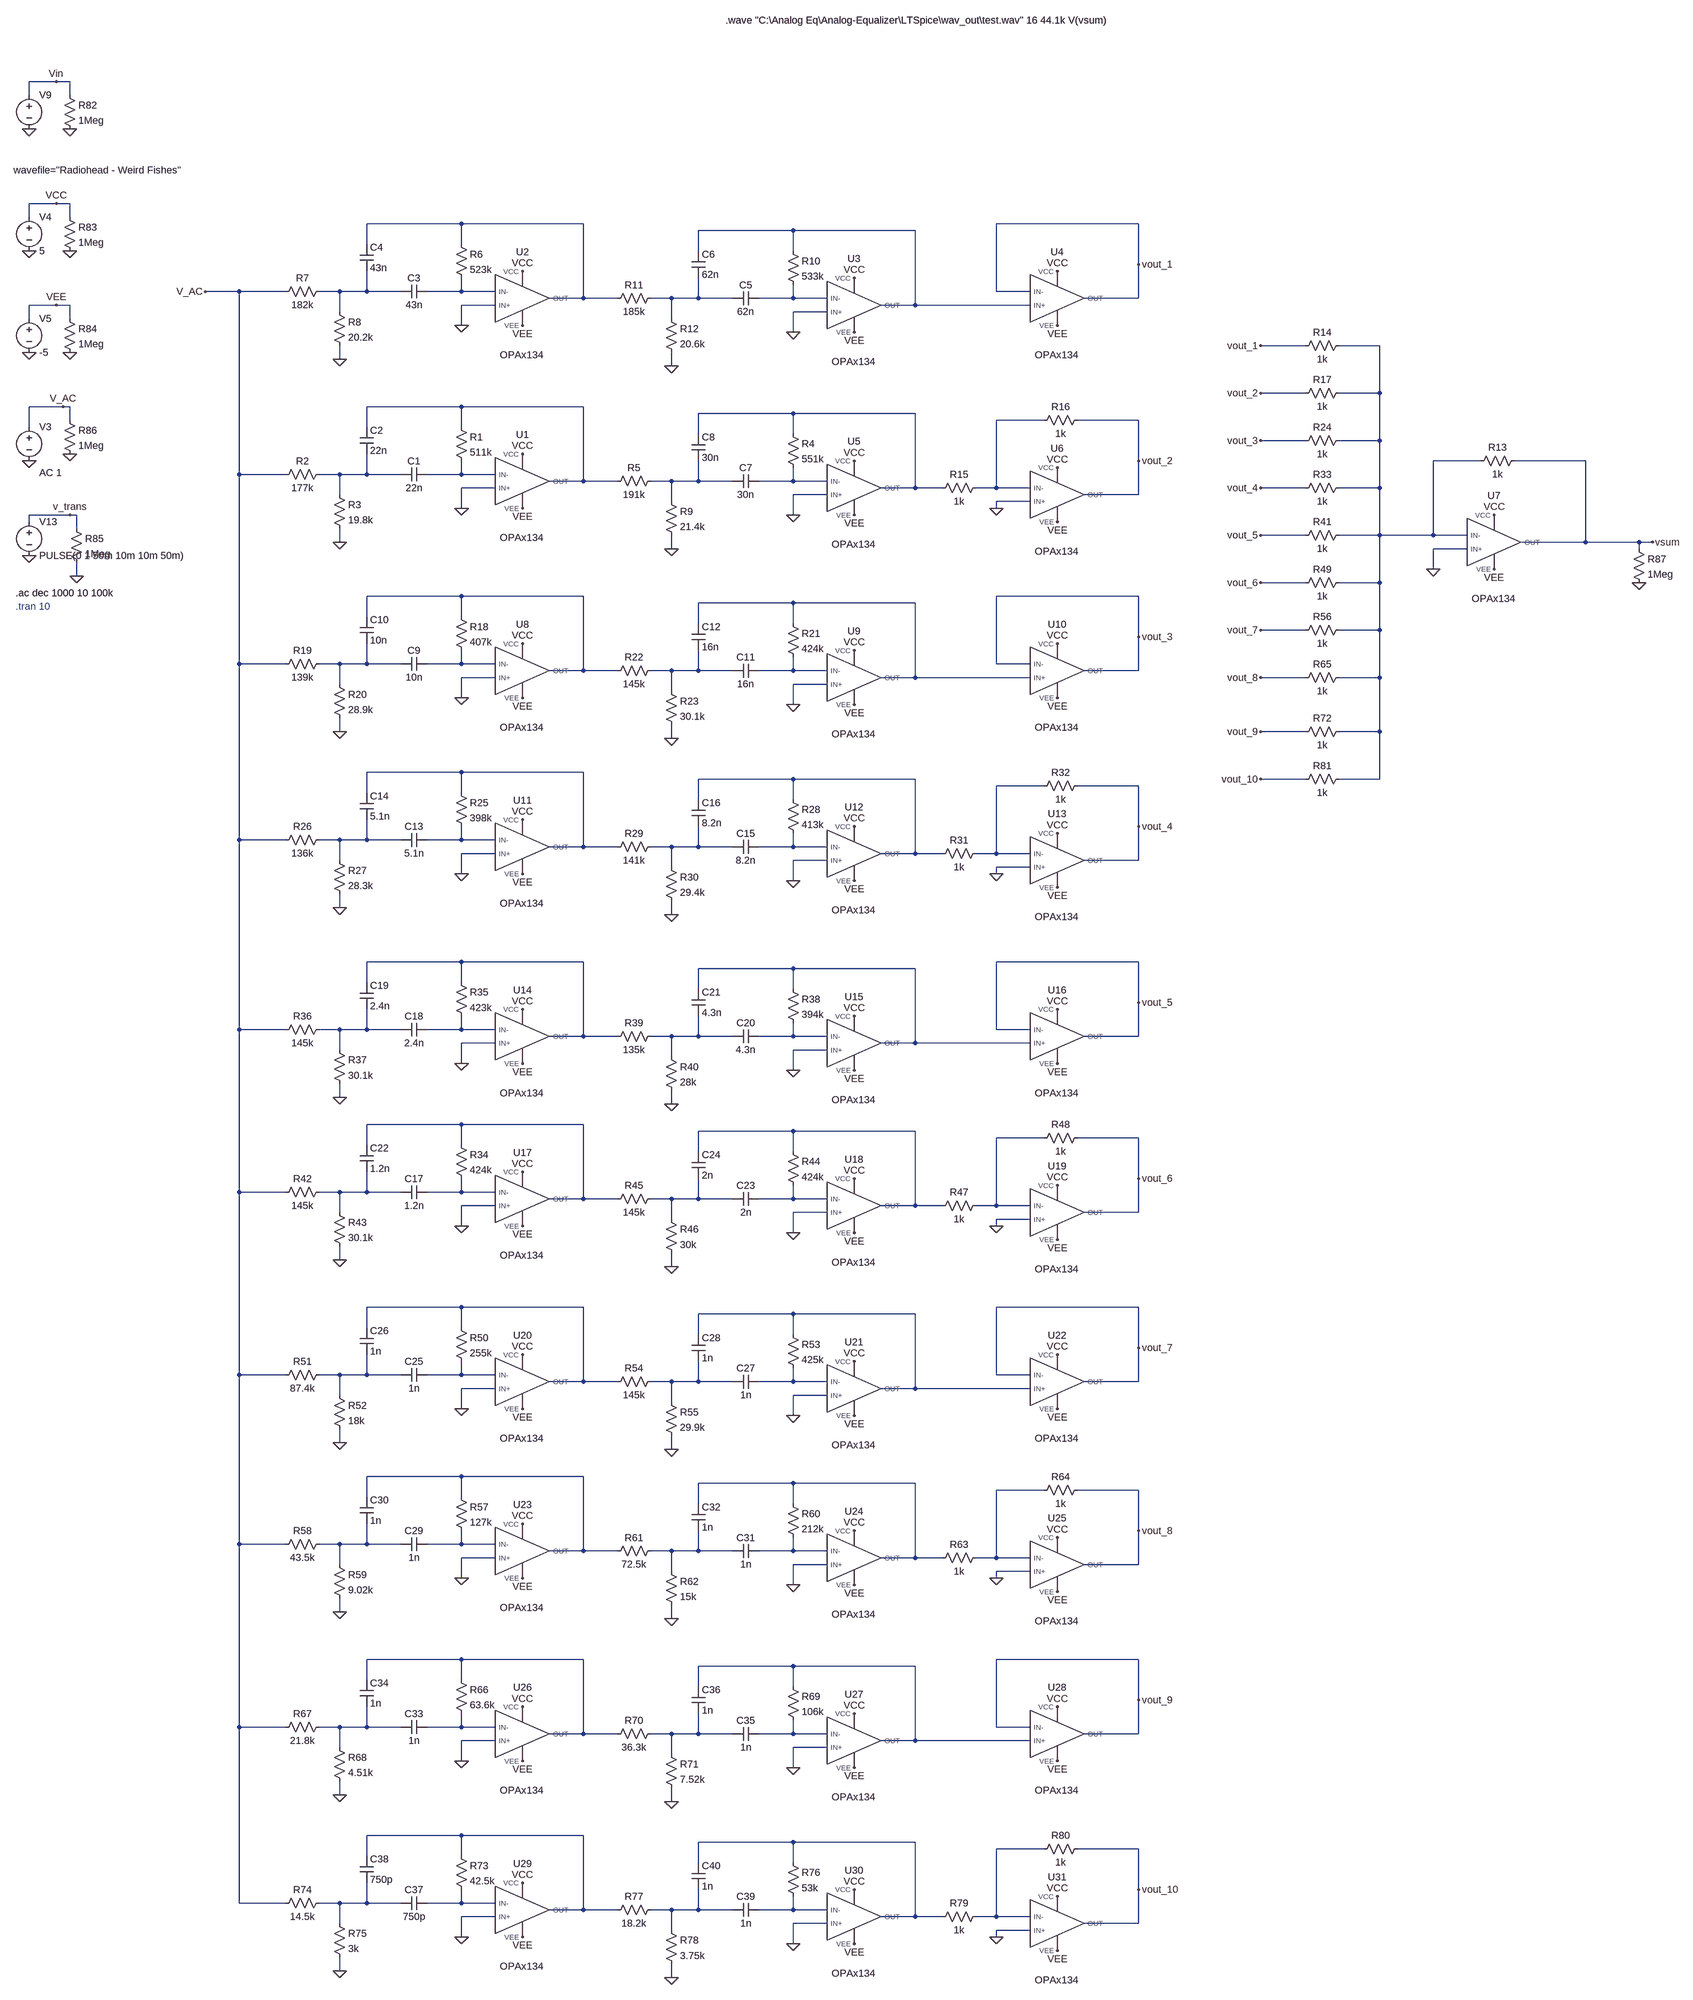
[diagram p0: schematic analog_eq_linkwitz_riley.asc]
analog_eq_linkwitz_riley.asc, the LTspice schematic file:
Version 4.1
SHEET 1 3844 4724
WIRE -512 224 -576 224
WIRE -480 224 -512 224
WIRE -576 256 -576 224
WIRE -480 256 -480 224
WIRE -512 512 -576 512
WIRE -480 512 -512 512
WIRE -576 544 -576 512
WIRE -480 544 -480 512
WIRE 464 560 240 560
WIRE 752 560 464 560
WIRE 2064 560 1728 560
WIRE 1248 576 1024 576
WIRE 1536 576 1248 576
WIRE 240 608 240 560
WIRE 464 608 464 560
WIRE 1024 624 1024 576
WIRE 1248 624 1248 576
WIRE 2064 656 2064 560
WIRE -80 720 -160 720
WIRE 48 720 -80 720
WIRE 176 720 128 720
WIRE 240 720 240 672
WIRE 240 720 176 720
WIRE 320 720 240 720
WIRE 464 720 464 688
WIRE 464 720 384 720
WIRE 544 720 464 720
WIRE 1728 720 1728 560
WIRE 1808 720 1728 720
WIRE 752 736 752 560
WIRE 752 736 672 736
WIRE 832 736 752 736
WIRE 960 736 912 736
WIRE 1024 736 1024 688
WIRE 1024 736 960 736
WIRE 1104 736 1024 736
WIRE 1248 736 1248 704
WIRE 1248 736 1168 736
WIRE 1328 736 1248 736
WIRE 2064 736 2064 656
WIRE 2064 736 1936 736
WIRE -512 752 -576 752
WIRE -480 752 -512 752
WIRE 544 752 464 752
WIRE 1536 752 1536 576
WIRE 1536 752 1456 752
WIRE 1808 752 1536 752
WIRE 176 768 176 720
WIRE 1328 768 1248 768
WIRE -576 784 -576 752
WIRE -480 784 -480 752
WIRE 960 784 960 736
WIRE 464 800 464 752
WIRE 1248 816 1248 768
WIRE 2768 848 2656 848
WIRE 2944 848 2848 848
WIRE 176 880 176 848
WIRE 960 896 960 864
WIRE 2768 960 2656 960
WIRE 2944 960 2944 848
WIRE 2944 960 2848 960
WIRE -496 992 -576 992
WIRE -480 992 -496 992
WIRE 464 992 240 992
WIRE 752 992 464 992
WIRE 1248 1008 1024 1008
WIRE 1536 1008 1248 1008
WIRE -480 1024 -480 992
WIRE 1840 1024 1728 1024
WIRE 2064 1024 1920 1024
WIRE -576 1040 -576 992
WIRE 240 1040 240 992
WIRE 464 1040 464 992
WIRE 1024 1056 1024 1008
WIRE 1248 1056 1248 1008
WIRE 2768 1072 2656 1072
WIRE 2944 1072 2944 960
WIRE 2944 1072 2848 1072
WIRE 2064 1120 2064 1024
WIRE 3184 1120 3072 1120
WIRE 3440 1120 3264 1120
WIRE -80 1152 -80 720
WIRE 48 1152 -80 1152
WIRE 176 1152 128 1152
WIRE 240 1152 240 1104
WIRE 240 1152 176 1152
WIRE 320 1152 240 1152
WIRE 464 1152 464 1120
WIRE 464 1152 384 1152
WIRE 544 1152 464 1152
WIRE 752 1168 752 992
WIRE 752 1168 672 1168
WIRE 832 1168 752 1168
WIRE 960 1168 912 1168
WIRE 1024 1168 1024 1120
WIRE 1024 1168 960 1168
WIRE 1104 1168 1024 1168
WIRE 1248 1168 1248 1136
WIRE 1248 1168 1168 1168
WIRE 1328 1168 1248 1168
WIRE 544 1184 464 1184
WIRE 1536 1184 1536 1008
WIRE 1536 1184 1456 1184
WIRE 1600 1184 1536 1184
WIRE 1728 1184 1728 1024
WIRE 1728 1184 1680 1184
WIRE 1808 1184 1728 1184
WIRE 2768 1184 2656 1184
WIRE 2944 1184 2944 1072
WIRE 2944 1184 2848 1184
WIRE 176 1200 176 1152
WIRE 1328 1200 1248 1200
WIRE 2064 1200 2064 1120
WIRE 2064 1200 1936 1200
WIRE 960 1216 960 1168
WIRE 1808 1216 1728 1216
WIRE 464 1232 464 1184
WIRE 1728 1232 1728 1216
WIRE -480 1248 -576 1248
WIRE -464 1248 -480 1248
WIRE 1248 1248 1248 1200
WIRE -576 1264 -576 1248
WIRE -464 1280 -464 1248
WIRE 2768 1296 2656 1296
WIRE 2944 1296 2944 1184
WIRE 2944 1296 2848 1296
WIRE 3072 1296 3072 1120
WIRE 3072 1296 2944 1296
WIRE 3152 1296 3072 1296
WIRE 176 1312 176 1280
WIRE 3440 1312 3440 1120
WIRE 3440 1312 3280 1312
WIRE 3600 1312 3440 1312
WIRE 3632 1312 3600 1312
WIRE 960 1328 960 1296
WIRE 3152 1328 3072 1328
WIRE 3600 1328 3600 1312
WIRE 3072 1376 3072 1328
WIRE -464 1392 -464 1360
WIRE 2768 1408 2656 1408
WIRE 2944 1408 2944 1296
WIRE 2944 1408 2848 1408
WIRE 464 1440 240 1440
WIRE 752 1440 464 1440
WIRE 2064 1440 1728 1440
WIRE 1248 1456 1024 1456
WIRE 1536 1456 1248 1456
WIRE 240 1488 240 1440
WIRE 464 1488 464 1440
WIRE 1024 1504 1024 1456
WIRE 1248 1504 1248 1456
WIRE 2768 1520 2656 1520
WIRE 2944 1520 2944 1408
WIRE 2944 1520 2848 1520
WIRE 2064 1536 2064 1440
WIRE -80 1600 -80 1152
WIRE 48 1600 -80 1600
WIRE 176 1600 128 1600
WIRE 240 1600 240 1552
WIRE 240 1600 176 1600
WIRE 320 1600 240 1600
WIRE 464 1600 464 1568
WIRE 464 1600 384 1600
WIRE 544 1600 464 1600
WIRE 1728 1600 1728 1440
WIRE 1808 1600 1728 1600
WIRE 752 1616 752 1440
WIRE 752 1616 672 1616
WIRE 832 1616 752 1616
WIRE 960 1616 912 1616
WIRE 1024 1616 1024 1568
WIRE 1024 1616 960 1616
WIRE 1104 1616 1024 1616
WIRE 1248 1616 1248 1584
WIRE 1248 1616 1168 1616
WIRE 1328 1616 1248 1616
WIRE 2064 1616 2064 1536
WIRE 2064 1616 1936 1616
WIRE 544 1632 464 1632
WIRE 1536 1632 1536 1456
WIRE 1536 1632 1456 1632
WIRE 1808 1632 1536 1632
WIRE 2768 1632 2656 1632
WIRE 2944 1632 2944 1520
WIRE 2944 1632 2848 1632
WIRE 176 1648 176 1600
WIRE 1328 1648 1248 1648
WIRE 960 1664 960 1616
WIRE 464 1680 464 1632
WIRE 1248 1696 1248 1648
WIRE 176 1760 176 1728
WIRE 2768 1760 2656 1760
WIRE 2944 1760 2944 1632
WIRE 2944 1760 2848 1760
WIRE 960 1776 960 1744
WIRE 464 1856 240 1856
WIRE 752 1856 464 1856
WIRE 1248 1872 1024 1872
WIRE 1536 1872 1248 1872
WIRE 2768 1872 2656 1872
WIRE 2944 1872 2944 1760
WIRE 2944 1872 2848 1872
WIRE 1840 1888 1728 1888
WIRE 2064 1888 1920 1888
WIRE 240 1904 240 1856
WIRE 464 1904 464 1856
WIRE 1024 1920 1024 1872
WIRE 1248 1920 1248 1872
WIRE 2064 1984 2064 1888
WIRE -80 2016 -80 1600
WIRE 48 2016 -80 2016
WIRE 176 2016 128 2016
WIRE 240 2016 240 1968
WIRE 240 2016 176 2016
WIRE 320 2016 240 2016
WIRE 464 2016 464 1984
WIRE 464 2016 384 2016
WIRE 544 2016 464 2016
WIRE 752 2032 752 1856
WIRE 752 2032 672 2032
WIRE 832 2032 752 2032
WIRE 960 2032 912 2032
WIRE 1024 2032 1024 1984
WIRE 1024 2032 960 2032
WIRE 1104 2032 1024 2032
WIRE 1248 2032 1248 2000
WIRE 1248 2032 1168 2032
WIRE 1328 2032 1248 2032
WIRE 544 2048 464 2048
WIRE 1536 2048 1536 1872
WIRE 1536 2048 1456 2048
WIRE 1600 2048 1536 2048
WIRE 1728 2048 1728 1888
WIRE 1728 2048 1680 2048
WIRE 1808 2048 1728 2048
WIRE 176 2064 176 2016
WIRE 1328 2064 1248 2064
WIRE 2064 2064 2064 1984
WIRE 2064 2064 1936 2064
WIRE 960 2080 960 2032
WIRE 1808 2080 1728 2080
WIRE 464 2096 464 2048
WIRE 1728 2096 1728 2080
WIRE 1248 2112 1248 2064
WIRE 176 2176 176 2144
WIRE 960 2192 960 2160
WIRE 464 2304 240 2304
WIRE 752 2304 464 2304
WIRE 2064 2304 1728 2304
WIRE 1248 2320 1024 2320
WIRE 1536 2320 1248 2320
WIRE 240 2352 240 2304
WIRE 464 2352 464 2304
WIRE 1024 2368 1024 2320
WIRE 1248 2368 1248 2320
WIRE 2064 2400 2064 2304
WIRE -80 2464 -80 2016
WIRE 48 2464 -80 2464
WIRE 176 2464 128 2464
WIRE 240 2464 240 2416
WIRE 240 2464 176 2464
WIRE 320 2464 240 2464
WIRE 464 2464 464 2432
WIRE 464 2464 384 2464
WIRE 544 2464 464 2464
WIRE 1728 2464 1728 2304
WIRE 1808 2464 1728 2464
WIRE 752 2480 752 2304
WIRE 752 2480 672 2480
WIRE 832 2480 752 2480
WIRE 960 2480 912 2480
WIRE 1024 2480 1024 2432
WIRE 1024 2480 960 2480
WIRE 1104 2480 1024 2480
WIRE 1248 2480 1248 2448
WIRE 1248 2480 1168 2480
WIRE 1328 2480 1248 2480
WIRE 2064 2480 2064 2400
WIRE 2064 2480 1936 2480
WIRE 544 2496 464 2496
WIRE 1536 2496 1536 2320
WIRE 1536 2496 1456 2496
WIRE 1808 2496 1536 2496
WIRE 176 2512 176 2464
WIRE 1328 2512 1248 2512
WIRE 960 2528 960 2480
WIRE 464 2544 464 2496
WIRE 1248 2560 1248 2512
WIRE 176 2624 176 2592
WIRE 960 2640 960 2608
WIRE 464 2688 240 2688
WIRE 752 2688 464 2688
WIRE 1248 2704 1024 2704
WIRE 1536 2704 1248 2704
WIRE 1840 2720 1728 2720
WIRE 2064 2720 1920 2720
WIRE 240 2736 240 2688
WIRE 464 2736 464 2688
WIRE 1024 2752 1024 2704
WIRE 1248 2752 1248 2704
WIRE 2064 2816 2064 2720
WIRE -80 2848 -80 2464
WIRE 48 2848 -80 2848
WIRE 176 2848 128 2848
WIRE 240 2848 240 2800
WIRE 240 2848 176 2848
WIRE 320 2848 240 2848
WIRE 464 2848 464 2816
WIRE 464 2848 384 2848
WIRE 544 2848 464 2848
WIRE 752 2864 752 2688
WIRE 752 2864 672 2864
WIRE 832 2864 752 2864
WIRE 960 2864 912 2864
WIRE 1024 2864 1024 2816
WIRE 1024 2864 960 2864
WIRE 1104 2864 1024 2864
WIRE 1248 2864 1248 2832
WIRE 1248 2864 1168 2864
WIRE 1328 2864 1248 2864
WIRE 544 2880 464 2880
WIRE 1536 2880 1536 2704
WIRE 1536 2880 1456 2880
WIRE 1600 2880 1536 2880
WIRE 1728 2880 1728 2720
WIRE 1728 2880 1680 2880
WIRE 1808 2880 1728 2880
WIRE 176 2896 176 2848
WIRE 1328 2896 1248 2896
WIRE 2064 2896 2064 2816
WIRE 2064 2896 1936 2896
WIRE 960 2912 960 2864
WIRE 1808 2912 1728 2912
WIRE 464 2928 464 2880
WIRE 1728 2928 1728 2912
WIRE 1248 2944 1248 2896
WIRE 176 3008 176 2976
WIRE 960 3024 960 2992
WIRE 464 3120 240 3120
WIRE 752 3120 464 3120
WIRE 2064 3120 1728 3120
WIRE 1248 3136 1024 3136
WIRE 1536 3136 1248 3136
WIRE 240 3168 240 3120
WIRE 464 3168 464 3120
WIRE 1024 3184 1024 3136
WIRE 1248 3184 1248 3136
WIRE 2064 3216 2064 3120
WIRE -80 3280 -80 2848
WIRE 48 3280 -80 3280
WIRE 176 3280 128 3280
WIRE 240 3280 240 3232
WIRE 240 3280 176 3280
WIRE 320 3280 240 3280
WIRE 464 3280 464 3248
WIRE 464 3280 384 3280
WIRE 544 3280 464 3280
WIRE 1728 3280 1728 3120
WIRE 1808 3280 1728 3280
WIRE 752 3296 752 3120
WIRE 752 3296 672 3296
WIRE 832 3296 752 3296
WIRE 960 3296 912 3296
WIRE 1024 3296 1024 3248
WIRE 1024 3296 960 3296
WIRE 1104 3296 1024 3296
WIRE 1248 3296 1248 3264
WIRE 1248 3296 1168 3296
WIRE 1328 3296 1248 3296
WIRE 2064 3296 2064 3216
WIRE 2064 3296 1936 3296
WIRE 544 3312 464 3312
WIRE 1536 3312 1536 3136
WIRE 1536 3312 1456 3312
WIRE 1808 3312 1536 3312
WIRE 176 3328 176 3280
WIRE 1328 3328 1248 3328
WIRE 960 3344 960 3296
WIRE 464 3360 464 3312
WIRE 1248 3376 1248 3328
WIRE 176 3440 176 3408
WIRE 960 3456 960 3424
WIRE 464 3520 240 3520
WIRE 752 3520 464 3520
WIRE 1248 3536 1024 3536
WIRE 1536 3536 1248 3536
WIRE 1840 3552 1728 3552
WIRE 2064 3552 1920 3552
WIRE 240 3568 240 3520
WIRE 464 3568 464 3520
WIRE 1024 3584 1024 3536
WIRE 1248 3584 1248 3536
WIRE 2064 3648 2064 3552
WIRE -80 3680 -80 3280
WIRE 48 3680 -80 3680
WIRE 176 3680 128 3680
WIRE 240 3680 240 3632
WIRE 240 3680 176 3680
WIRE 320 3680 240 3680
WIRE 464 3680 464 3648
WIRE 464 3680 384 3680
WIRE 544 3680 464 3680
WIRE 752 3696 752 3520
WIRE 752 3696 672 3696
WIRE 832 3696 752 3696
WIRE 960 3696 912 3696
WIRE 1024 3696 1024 3648
WIRE 1024 3696 960 3696
WIRE 1104 3696 1024 3696
WIRE 1248 3696 1248 3664
WIRE 1248 3696 1168 3696
WIRE 1328 3696 1248 3696
WIRE 544 3712 464 3712
WIRE 1536 3712 1536 3536
WIRE 1536 3712 1456 3712
WIRE 1600 3712 1536 3712
WIRE 1728 3712 1728 3552
WIRE 1728 3712 1680 3712
WIRE 1808 3712 1728 3712
WIRE 176 3728 176 3680
WIRE 1328 3728 1248 3728
WIRE 2064 3728 2064 3648
WIRE 2064 3728 1936 3728
WIRE 960 3744 960 3696
WIRE 1808 3744 1728 3744
WIRE 464 3760 464 3712
WIRE 1728 3760 1728 3744
WIRE 1248 3776 1248 3728
WIRE 176 3840 176 3808
WIRE 960 3856 960 3824
WIRE 464 3952 240 3952
WIRE 752 3952 464 3952
WIRE 2064 3952 1728 3952
WIRE 1248 3968 1024 3968
WIRE 1536 3968 1248 3968
WIRE 240 4000 240 3952
WIRE 464 4000 464 3952
WIRE 1024 4016 1024 3968
WIRE 1248 4016 1248 3968
WIRE 2064 4048 2064 3952
WIRE -80 4112 -80 3680
WIRE 48 4112 -80 4112
WIRE 176 4112 128 4112
WIRE 240 4112 240 4064
WIRE 240 4112 176 4112
WIRE 320 4112 240 4112
WIRE 464 4112 464 4080
WIRE 464 4112 384 4112
WIRE 544 4112 464 4112
WIRE 1728 4112 1728 3952
WIRE 1808 4112 1728 4112
WIRE 752 4128 752 3952
WIRE 752 4128 672 4128
WIRE 832 4128 752 4128
WIRE 960 4128 912 4128
WIRE 1024 4128 1024 4080
WIRE 1024 4128 960 4128
WIRE 1104 4128 1024 4128
WIRE 1248 4128 1248 4096
WIRE 1248 4128 1168 4128
WIRE 1328 4128 1248 4128
WIRE 2064 4128 2064 4048
WIRE 2064 4128 1936 4128
WIRE 544 4144 464 4144
WIRE 1536 4144 1536 3968
WIRE 1536 4144 1456 4144
WIRE 1808 4144 1536 4144
WIRE 176 4160 176 4112
WIRE 1328 4160 1248 4160
WIRE 960 4176 960 4128
WIRE 464 4192 464 4144
WIRE 1248 4208 1248 4160
WIRE 176 4272 176 4240
WIRE 960 4288 960 4256
WIRE 464 4368 240 4368
WIRE 752 4368 464 4368
WIRE 1248 4384 1024 4384
WIRE 1536 4384 1248 4384
WIRE 1840 4400 1728 4400
WIRE 2064 4400 1920 4400
WIRE 240 4416 240 4368
WIRE 464 4416 464 4368
WIRE 1024 4432 1024 4384
WIRE 1248 4432 1248 4384
WIRE 2064 4496 2064 4400
WIRE -80 4528 -80 4112
WIRE 48 4528 -80 4528
WIRE 176 4528 128 4528
WIRE 240 4528 240 4480
WIRE 240 4528 176 4528
WIRE 320 4528 240 4528
WIRE 464 4528 464 4496
WIRE 464 4528 384 4528
WIRE 544 4528 464 4528
WIRE 752 4544 752 4368
WIRE 752 4544 672 4544
WIRE 832 4544 752 4544
WIRE 960 4544 912 4544
WIRE 1024 4544 1024 4496
WIRE 1024 4544 960 4544
WIRE 1104 4544 1024 4544
WIRE 1248 4544 1248 4512
WIRE 1248 4544 1168 4544
WIRE 1328 4544 1248 4544
WIRE 544 4560 464 4560
WIRE 1536 4560 1536 4384
WIRE 1536 4560 1456 4560
WIRE 1600 4560 1536 4560
WIRE 1728 4560 1728 4400
WIRE 1728 4560 1680 4560
WIRE 1808 4560 1728 4560
WIRE 176 4576 176 4528
WIRE 1328 4576 1248 4576
WIRE 2064 4576 2064 4496
WIRE 2064 4576 1936 4576
WIRE 960 4592 960 4544
WIRE 1808 4592 1728 4592
WIRE 464 4608 464 4560
WIRE 1728 4608 1728 4592
WIRE 1248 4624 1248 4576
WIRE 176 4688 176 4656
WIRE 960 4704 960 4672
FLAG 176 880 0
FLAG 464 800 0
FLAG 960 896 0
FLAG 1248 816 0
FLAG -576 864 0
FLAG -576 624 0
FLAG -512 512 VCC
FLAG -512 752 VEE
FLAG 608 672 VCC
FLAG 608 800 VEE
FLAG 1392 688 VCC
FLAG 1392 816 VEE
FLAG 1872 672 VCC
FLAG 1872 800 VEE
FLAG 2064 656 vout_1
FLAG 176 1312 0
FLAG 464 1232 0
FLAG 960 1328 0
FLAG 1248 1248 0
FLAG 608 1104 VCC
FLAG 608 1232 VEE
FLAG 1392 1120 VCC
FLAG 1392 1248 VEE
FLAG 1872 1136 VCC
FLAG 1872 1264 VEE
FLAG 1728 1232 0
FLAG 2064 1120 vout_2
FLAG -576 336 0
FLAG -512 224 Vin
FLAG -576 1120 0
FLAG 3216 1248 VCC
FLAG 3216 1376 VEE
FLAG 2656 848 vout_1
FLAG 2656 960 vout_2
FLAG 3072 1376 0
FLAG 176 1760 0
FLAG 464 1680 0
FLAG 960 1776 0
FLAG 1248 1696 0
FLAG 608 1552 VCC
FLAG 608 1680 VEE
FLAG 1392 1568 VCC
FLAG 1392 1696 VEE
FLAG 1872 1552 VCC
FLAG 1872 1680 VEE
FLAG 2064 1536 vout_3
FLAG 2656 1072 vout_3
FLAG 176 2176 0
FLAG 464 2096 0
FLAG 960 2192 0
FLAG 1248 2112 0
FLAG 608 1968 VCC
FLAG 608 2096 VEE
FLAG 1392 1984 VCC
FLAG 1392 2112 VEE
FLAG 1872 2000 VCC
FLAG 1872 2128 VEE
FLAG 1728 2096 0
FLAG 2064 1984 vout_4
FLAG 2656 1184 vout_4
FLAG 3632 1312 vsum
FLAG 176 2624 0
FLAG 464 2544 0
FLAG 960 2640 0
FLAG 1248 2560 0
FLAG 608 2416 VCC
FLAG 608 2544 VEE
FLAG 1392 2432 VCC
FLAG 1392 2560 VEE
FLAG 1872 2416 VCC
FLAG 1872 2544 VEE
FLAG 2064 2400 vout_5
FLAG 2656 1296 vout_5
FLAG 176 3008 0
FLAG 464 2928 0
FLAG 960 3024 0
FLAG 1248 2944 0
FLAG 608 2800 VCC
FLAG 608 2928 VEE
FLAG 1392 2816 VCC
FLAG 1392 2944 VEE
FLAG 1872 2832 VCC
FLAG 1872 2960 VEE
FLAG 1728 2928 0
FLAG 2064 2816 vout_6
FLAG 2656 1408 vout_6
FLAG 176 3440 0
FLAG 464 3360 0
FLAG 960 3456 0
FLAG 1248 3376 0
FLAG 608 3232 VCC
FLAG 608 3360 VEE
FLAG 1392 3248 VCC
FLAG 1392 3376 VEE
FLAG 1872 3232 VCC
FLAG 1872 3360 VEE
FLAG 2064 3216 vout_7
FLAG 2656 1520 vout_7
FLAG 176 3840 0
FLAG 464 3760 0
FLAG 960 3856 0
FLAG 1248 3776 0
FLAG 608 3632 VCC
FLAG 608 3760 VEE
FLAG 1392 3648 VCC
FLAG 1392 3776 VEE
FLAG 1872 3664 VCC
FLAG 1872 3792 VEE
FLAG 1728 3760 0
FLAG 2064 3648 vout_8
FLAG 2656 1632 vout_8
FLAG -576 1344 0
FLAG -480 1248 v_trans
FLAG 176 4272 0
FLAG 464 4192 0
FLAG 960 4288 0
FLAG 1248 4208 0
FLAG 608 4064 VCC
FLAG 608 4192 VEE
FLAG 1392 4080 VCC
FLAG 1392 4208 VEE
FLAG 1872 4064 VCC
FLAG 1872 4192 VEE
FLAG 2064 4048 vout_9
FLAG 2656 1760 vout_9
FLAG 176 4688 0
FLAG 464 4608 0
FLAG 960 4704 0
FLAG 1248 4624 0
FLAG 608 4480 VCC
FLAG 608 4608 VEE
FLAG 1392 4496 VCC
FLAG 1392 4624 VEE
FLAG 1872 4512 VCC
FLAG 1872 4640 VEE
FLAG 1728 4608 0
FLAG 2064 4496 vout_10
FLAG 2656 1872 vout_10
FLAG -496 992 V_AC
FLAG -464 1392 0
FLAG -480 336 0
FLAG -480 624 0
FLAG -480 864 0
FLAG -480 1104 0
FLAG 3600 1408 0
FLAG -160 720 V_AC
SYMBOL cap 384 704 R90
WINDOW 0 0 32 VBottom 2
WINDOW 3 32 32 VTop 2
SYMATTR InstName C3
SYMATTR Value 43n
SYMBOL cap 224 608 R0
SYMATTR InstName C4
SYMATTR Value 43n
SYMBOL res 448 592 R0
SYMATTR InstName R6
SYMATTR Value 523k
SYMBOL res 144 704 R90
WINDOW 0 0 56 VBottom 2
WINDOW 3 32 56 VTop 2
SYMATTR InstName R7
SYMATTR Value 182k
SYMBOL res 160 752 R0
SYMATTR InstName R8
SYMATTR Value 20.2k
SYMBOL sym\\OPAx134 608 736 R0
SYMATTR InstName U2
SYMBOL cap 1168 720 R90
WINDOW 0 0 32 VBottom 2
WINDOW 3 32 32 VTop 2
SYMATTR InstName C5
SYMATTR Value 62n
SYMBOL cap 1008 624 R0
SYMATTR InstName C6
SYMATTR Value 62n
SYMBOL res 1232 608 R0
SYMATTR InstName R10
SYMATTR Value 533k
SYMBOL res 928 720 R90
WINDOW 0 0 56 VBottom 2
WINDOW 3 32 56 VTop 2
SYMATTR InstName R11
SYMATTR Value 185k
SYMBOL res 944 768 R0
SYMATTR InstName R12
SYMATTR Value 20.6k
SYMBOL sym\\OPAx134 1392 752 R0
SYMATTR InstName U3
SYMBOL voltage -576 240 R0
WINDOW 3 -37 193 Left 2
SYMATTR Value wavefile="Radiohead - Weird Fishes"
SYMATTR InstName V9
SYMBOL sym\\OPAx134 1872 736 R0
SYMATTR InstName U4
SYMBOL voltage -576 528 R0
WINDOW 123 0 0 Left 0
WINDOW 39 0 0 Left 0
SYMATTR InstName V4
SYMATTR Value 5
SYMBOL voltage -576 768 R0
WINDOW 123 0 0 Left 0
WINDOW 39 0 0 Left 0
SYMATTR InstName V5
SYMATTR Value -5
SYMBOL cap 384 1136 R90
WINDOW 0 0 32 VBottom 2
WINDOW 3 32 32 VTop 2
SYMATTR InstName C1
SYMATTR Value 22n
SYMBOL cap 224 1040 R0
SYMATTR InstName C2
SYMATTR Value 22n
SYMBOL res 448 1024 R0
SYMATTR InstName R1
SYMATTR Value 511k
SYMBOL res 144 1136 R90
WINDOW 0 0 56 VBottom 2
WINDOW 3 32 56 VTop 2
SYMATTR InstName R2
SYMATTR Value 177k
SYMBOL res 160 1184 R0
SYMATTR InstName R3
SYMATTR Value 19.8k
SYMBOL sym\\OPAx134 608 1168 R0
SYMATTR InstName U1
SYMBOL cap 1168 1152 R90
WINDOW 0 0 32 VBottom 2
WINDOW 3 32 32 VTop 2
SYMATTR InstName C7
SYMATTR Value 30n
SYMBOL cap 1008 1056 R0
SYMATTR InstName C8
SYMATTR Value 30n
SYMBOL res 1232 1040 R0
SYMATTR InstName R4
SYMATTR Value 551k
SYMBOL res 928 1152 R90
WINDOW 0 0 56 VBottom 2
WINDOW 3 32 56 VTop 2
SYMATTR InstName R5
SYMATTR Value 191k
SYMBOL res 944 1200 R0
SYMATTR InstName R9
SYMATTR Value 21.4k
SYMBOL sym\\OPAx134 1392 1184 R0
SYMATTR InstName U5
SYMBOL sym\\OPAx134 1872 1200 R0
SYMATTR InstName U6
SYMBOL res 1696 1168 R90
WINDOW 0 0 56 VBottom 2
WINDOW 3 32 56 VTop 2
SYMATTR InstName R15
SYMATTR Value 1k
SYMBOL res 1936 1008 R90
WINDOW 0 0 56 VBottom 2
WINDOW 3 32 56 VTop 2
SYMATTR InstName R16
SYMATTR Value 1k
SYMBOL voltage -576 1024 R0
WINDOW 123 24 124 Left 2
WINDOW 39 0 0 Left 0
SYMATTR InstName V3
SYMATTR Value ""
SYMATTR Value2 AC 1
SYMBOL sym\\OPAx134 3216 1312 R0
SYMATTR InstName U7
SYMBOL res 3280 1104 R90
WINDOW 0 0 56 VBottom 2
WINDOW 3 32 56 VTop 2
SYMATTR InstName R13
SYMATTR Value 1k
SYMBOL res 2864 832 R90
WINDOW 0 0 56 VBottom 2
WINDOW 3 32 56 VTop 2
SYMATTR InstName R14
SYMATTR Value 1k
SYMBOL res 2864 944 R90
WINDOW 0 0 56 VBottom 2
WINDOW 3 32 56 VTop 2
SYMATTR InstName R17
SYMATTR Value 1k
SYMBOL cap 384 1584 R90
WINDOW 0 0 32 VBottom 2
WINDOW 3 32 32 VTop 2
SYMATTR InstName C9
SYMATTR Value 10n
SYMBOL cap 224 1488 R0
SYMATTR InstName C10
SYMATTR Value 10n
SYMBOL res 448 1472 R0
SYMATTR InstName R18
SYMATTR Value 407k
SYMBOL res 144 1584 R90
WINDOW 0 0 56 VBottom 2
WINDOW 3 32 56 VTop 2
SYMATTR InstName R19
SYMATTR Value 139k
SYMBOL res 160 1632 R0
SYMATTR InstName R20
SYMATTR Value 28.9k
SYMBOL sym\\OPAx134 608 1616 R0
SYMATTR InstName U8
SYMBOL cap 1168 1600 R90
WINDOW 0 0 32 VBottom 2
WINDOW 3 32 32 VTop 2
SYMATTR InstName C11
SYMATTR Value 16n
SYMBOL cap 1008 1504 R0
SYMATTR InstName C12
SYMATTR Value 16n
SYMBOL res 1232 1488 R0
SYMATTR InstName R21
SYMATTR Value 424k
SYMBOL res 928 1600 R90
WINDOW 0 0 56 VBottom 2
WINDOW 3 32 56 VTop 2
SYMATTR InstName R22
SYMATTR Value 145k
SYMBOL res 944 1648 R0
SYMATTR InstName R23
SYMATTR Value 30.1k
SYMBOL sym\\OPAx134 1392 1632 R0
SYMATTR InstName U9
SYMBOL sym\\OPAx134 1872 1616 R0
SYMATTR InstName U10
SYMBOL res 2864 1056 R90
WINDOW 0 0 56 VBottom 2
WINDOW 3 32 56 VTop 2
SYMATTR InstName R24
SYMATTR Value 1k
SYMBOL cap 384 2000 R90
WINDOW 0 0 32 VBottom 2
WINDOW 3 32 32 VTop 2
SYMATTR InstName C13
SYMATTR Value 5.1n
SYMBOL cap 224 1904 R0
SYMATTR InstName C14
SYMATTR Value 5.1n
SYMBOL res 448 1888 R0
SYMATTR InstName R25
SYMATTR Value 398k
SYMBOL res 144 2000 R90
WINDOW 0 0 56 VBottom 2
WINDOW 3 32 56 VTop 2
SYMATTR InstName R26
SYMATTR Value 136k
SYMBOL res 160 2048 R0
SYMATTR InstName R27
SYMATTR Value 28.3k
SYMBOL sym\\OPAx134 608 2032 R0
SYMATTR InstName U11
SYMBOL cap 1168 2016 R90
WINDOW 0 0 32 VBottom 2
WINDOW 3 32 32 VTop 2
SYMATTR InstName C15
SYMATTR Value 8.2n
SYMBOL cap 1008 1920 R0
SYMATTR InstName C16
SYMATTR Value 8.2n
SYMBOL res 1232 1904 R0
SYMATTR InstName R28
SYMATTR Value 413k
SYMBOL res 928 2016 R90
WINDOW 0 0 56 VBottom 2
WINDOW 3 32 56 VTop 2
SYMATTR InstName R29
SYMATTR Value 141k
SYMBOL res 944 2064 R0
SYMATTR InstName R30
SYMATTR Value 29.4k
SYMBOL sym\\OPAx134 1392 2048 R0
SYMATTR InstName U12
SYMBOL sym\\OPAx134 1872 2064 R0
SYMATTR InstName U13
SYMBOL res 1696 2032 R90
WINDOW 0 0 56 VBottom 2
WINDOW 3 32 56 VTop 2
SYMATTR InstName R31
SYMATTR Value 1k
SYMBOL res 1936 1872 R90
WINDOW 0 0 56 VBottom 2
WINDOW 3 32 56 VTop 2
SYMATTR InstName R32
SYMATTR Value 1k
SYMBOL res 2864 1168 R90
WINDOW 0 0 56 VBottom 2
WINDOW 3 32 56 VTop 2
SYMATTR InstName R33
SYMATTR Value 1k
SYMBOL cap 384 2448 R90
WINDOW 0 0 32 VBottom 2
WINDOW 3 32 32 VTop 2
SYMATTR InstName C18
SYMATTR Value 2.4n
SYMBOL cap 224 2352 R0
SYMATTR InstName C19
SYMATTR Value 2.4n
SYMBOL res 448 2336 R0
SYMATTR InstName R35
SYMATTR Value 423k
SYMBOL res 144 2448 R90
WINDOW 0 0 56 VBottom 2
WINDOW 3 32 56 VTop 2
SYMATTR InstName R36
SYMATTR Value 145k
SYMBOL res 160 2496 R0
SYMATTR InstName R37
SYMATTR Value 30.1k
SYMBOL sym\\OPAx134 608 2480 R0
SYMATTR InstName U14
SYMBOL cap 1168 2464 R90
WINDOW 0 0 32 VBottom 2
WINDOW 3 32 32 VTop 2
SYMATTR InstName C20
SYMATTR Value 4.3n
SYMBOL cap 1008 2368 R0
SYMATTR InstName C21
SYMATTR Value 4.3n
SYMBOL res 1232 2352 R0
SYMATTR InstName R38
SYMATTR Value 394k
SYMBOL res 928 2464 R90
WINDOW 0 0 56 VBottom 2
WINDOW 3 32 56 VTop 2
SYMATTR InstName R39
SYMATTR Value 135k
SYMBOL res 944 2512 R0
SYMATTR InstName R40
SYMATTR Value 28k
SYMBOL sym\\OPAx134 1392 2496 R0
SYMATTR InstName U15
SYMBOL sym\\OPAx134 1872 2480 R0
SYMATTR InstName U16
SYMBOL res 2864 1280 R90
WINDOW 0 0 56 VBottom 2
WINDOW 3 32 56 VTop 2
SYMATTR InstName R41
SYMATTR Value 1k
SYMBOL cap 384 2832 R90
WINDOW 0 0 32 VBottom 2
WINDOW 3 32 32 VTop 2
SYMATTR InstName C17
SYMATTR Value 1.2n
SYMBOL cap 224 2736 R0
SYMATTR InstName C22
SYMATTR Value 1.2n
SYMBOL res 448 2720 R0
SYMATTR InstName R34
SYMATTR Value 424k
SYMBOL res 144 2832 R90
WINDOW 0 0 56 VBottom 2
WINDOW 3 32 56 VTop 2
SYMATTR InstName R42
SYMATTR Value 145k
SYMBOL res 160 2880 R0
SYMATTR InstName R43
SYMATTR Value 30.1k
SYMBOL sym\\OPAx134 608 2864 R0
SYMATTR InstName U17
SYMBOL cap 1168 2848 R90
WINDOW 0 0 32 VBottom 2
WINDOW 3 32 32 VTop 2
SYMATTR InstName C23
SYMATTR Value 2n
SYMBOL cap 1008 2752 R0
SYMATTR InstName C24
SYMATTR Value 2n
SYMBOL res 1232 2736 R0
SYMATTR InstName R44
SYMATTR Value 424k
SYMBOL res 928 2848 R90
WINDOW 0 0 56 VBottom 2
WINDOW 3 32 56 VTop 2
SYMATTR InstName R45
SYMATTR Value 145k
SYMBOL res 944 2896 R0
SYMATTR InstName R46
SYMATTR Value 30k
SYMBOL sym\\OPAx134 1392 2880 R0
SYMATTR InstName U18
SYMBOL sym\\OPAx134 1872 2896 R0
SYMATTR InstName U19
SYMBOL res 1696 2864 R90
WINDOW 0 0 56 VBottom 2
WINDOW 3 32 56 VTop 2
SYMATTR InstName R47
SYMATTR Value 1k
SYMBOL res 1936 2704 R90
WINDOW 0 0 56 VBottom 2
WINDOW 3 32 56 VTop 2
SYMATTR InstName R48
SYMATTR Value 1k
SYMBOL res 2864 1392 R90
WINDOW 0 0 56 VBottom 2
WINDOW 3 32 56 VTop 2
SYMATTR InstName R49
SYMATTR Value 1k
SYMBOL cap 384 3264 R90
WINDOW 0 0 32 VBottom 2
WINDOW 3 32 32 VTop 2
SYMATTR InstName C25
SYMATTR Value 1n
SYMBOL cap 224 3168 R0
SYMATTR InstName C26
SYMATTR Value 1n
SYMBOL res 448 3152 R0
SYMATTR InstName R50
SYMATTR Value 255k
SYMBOL res 144 3264 R90
WINDOW 0 0 56 VBottom 2
WINDOW 3 32 56 VTop 2
SYMATTR InstName R51
SYMATTR Value 87.4k
SYMBOL res 160 3312 R0
SYMATTR InstName R52
SYMATTR Value 18k
SYMBOL sym\\OPAx134 608 3296 R0
SYMATTR InstName U20
SYMBOL cap 1168 3280 R90
WINDOW 0 0 32 VBottom 2
WINDOW 3 32 32 VTop 2
SYMATTR InstName C27
SYMATTR Value 1n
SYMBOL cap 1008 3184 R0
SYMATTR InstName C28
SYMATTR Value 1n
SYMBOL res 1232 3168 R0
SYMATTR InstName R53
SYMATTR Value 425k
SYMBOL res 928 3280 R90
WINDOW 0 0 56 VBottom 2
WINDOW 3 32 56 VTop 2
SYMATTR InstName R54
SYMATTR Value 145k
SYMBOL res 944 3328 R0
SYMATTR InstName R55
SYMATTR Value 29.9k
SYMBOL sym\\OPAx134 1392 3312 R0
SYMATTR InstName U21
SYMBOL sym\\OPAx134 1872 3296 R0
SYMATTR InstName U22
SYMBOL res 2864 1504 R90
WINDOW 0 0 56 VBottom 2
WINDOW 3 32 56 VTop 2
SYMATTR InstName R56
SYMATTR Value 1k
SYMBOL cap 384 3664 R90
WINDOW 0 0 32 VBottom 2
WINDOW 3 32 32 VTop 2
SYMATTR InstName C29
SYMATTR Value 1n
SYMBOL cap 224 3568 R0
SYMATTR InstName C30
SYMATTR Value 1n
SYMBOL res 448 3552 R0
SYMATTR InstName R57
SYMATTR Value 127k
SYMBOL res 144 3664 R90
WINDOW 0 0 56 VBottom 2
WINDOW 3 32 56 VTop 2
SYMATTR InstName R58
SYMATTR Value 43.5k
SYMBOL res 160 3712 R0
SYMATTR InstName R59
SYMATTR Value 9.02k
SYMBOL sym\\OPAx134 608 3696 R0
SYMATTR InstName U23
SYMBOL cap 1168 3680 R90
WINDOW 0 0 32 VBottom 2
WINDOW 3 32 32 VTop 2
SYMATTR InstName C31
SYMATTR Value 1n
SYMBOL cap 1008 3584 R0
SYMATTR InstName C32
SYMATTR Value 1n
SYMBOL res 1232 3568 R0
SYMATTR InstName R60
SYMATTR Value 212k
SYMBOL res 928 3680 R90
WINDOW 0 0 56 VBottom 2
WINDOW 3 32 56 VTop 2
SYMATTR InstName R61
SYMATTR Value 72.5k
SYMBOL res 944 3728 R0
SYMATTR InstName R62
SYMATTR Value 15k
SYMBOL sym\\OPAx134 1392 3712 R0
SYMATTR InstName U24
SYMBOL sym\\OPAx134 1872 3728 R0
SYMATTR InstName U25
SYMBOL res 1696 3696 R90
WINDOW 0 0 56 VBottom 2
WINDOW 3 32 56 VTop 2
SYMATTR InstName R63
SYMATTR Value 1k
SYMBOL res 1936 3536 R90
WINDOW 0 0 56 VBottom 2
WINDOW 3 32 56 VTop 2
SYMATTR InstName R64
SYMATTR Value 1k
SYMBOL res 2864 1616 R90
WINDOW 0 0 56 VBottom 2
WINDOW 3 32 56 VTop 2
SYMATTR InstName R65
SYMATTR Value 1k
SYMBOL voltage -576 1248 R0
WINDOW 123 0 0 Left 0
WINDOW 39 0 0 Left 0
SYMATTR InstName V13
SYMATTR Value PULSE(0 1 50m 10m 10m 50m)
SYMBOL cap 384 4096 R90
WINDOW 0 0 32 VBottom 2
WINDOW 3 32 32 VTop 2
SYMATTR InstName C33
SYMATTR Value 1n
SYMBOL cap 224 4000 R0
SYMATTR InstName C34
SYMATTR Value 1n
SYMBOL res 448 3984 R0
SYMATTR InstName R66
SYMATTR Value 63.6k
SYMBOL res 144 4096 R90
WINDOW 0 0 56 VBottom 2
WINDOW 3 32 56 VTop 2
SYMATTR InstName R67
SYMATTR Value 21.8k
SYMBOL res 160 4144 R0
SYMATTR InstName R68
SYMATTR Value 4.51k
SYMBOL sym\\OPAx134 608 4128 R0
SYMATTR InstName U26
SYMBOL cap 1168 4112 R90
WINDOW 0 0 32 VBottom 2
WINDOW 3 32 32 VTop 2
SYMATTR InstName C35
SYMATTR Value 1n
SYMBOL cap 1008 4016 R0
SYMATTR InstName C36
SYMATTR Value 1n
SYMBOL res 1232 4000 R0
SYMATTR InstName R69
SYMATTR Value 106k
SYMBOL res 928 4112 R90
WINDOW 0 0 56 VBottom 2
WINDOW 3 32 56 VTop 2
SYMATTR InstName R70
SYMATTR Value 36.3k
SYMBOL res 944 4160 R0
SYMATTR InstName R71
SYMATTR Value 7.52k
SYMBOL sym\\OPAx134 1392 4144 R0
SYMATTR InstName U27
SYMBOL sym\\OPAx134 1872 4128 R0
SYMATTR InstName U28
SYMBOL res 2864 1744 R90
WINDOW 0 0 56 VBottom 2
WINDOW 3 32 56 VTop 2
SYMATTR InstName R72
SYMATTR Value 1k
SYMBOL cap 384 4512 R90
WINDOW 0 0 32 VBottom 2
WINDOW 3 32 32 VTop 2
SYMATTR InstName C37
SYMATTR Value 750p
SYMBOL cap 224 4416 R0
SYMATTR InstName C38
SYMATTR Value 750p
SYMBOL res 448 4400 R0
SYMATTR InstName R73
SYMATTR Value 42.5k
SYMBOL res 144 4512 R90
WINDOW 0 0 56 VBottom 2
WINDOW 3 32 56 VTop 2
SYMATTR InstName R74
SYMATTR Value 14.5k
SYMBOL res 160 4560 R0
SYMATTR InstName R75
SYMATTR Value 3k
SYMBOL sym\\OPAx134 608 4544 R0
SYMATTR InstName U29
SYMBOL cap 1168 4528 R90
WINDOW 0 0 32 VBottom 2
WINDOW 3 32 32 VTop 2
SYMATTR InstName C39
SYMATTR Value 1n
SYMBOL cap 1008 4432 R0
SYMATTR InstName C40
SYMATTR Value 1n
SYMBOL res 1232 4416 R0
SYMATTR InstName R76
SYMATTR Value 53k
SYMBOL res 928 4528 R90
WINDOW 0 0 56 VBottom 2
WINDOW 3 32 56 VTop 2
SYMATTR InstName R77
SYMATTR Value 18.2k
SYMBOL res 944 4576 R0
SYMATTR InstName R78
SYMATTR Value 3.75k
SYMBOL sym\\OPAx134 1392 4560 R0
SYMATTR InstName U30
SYMBOL sym\\OPAx134 1872 4576 R0
SYMATTR InstName U31
SYMBOL res 1696 4544 R90
WINDOW 0 0 56 VBottom 2
WINDOW 3 32 56 VTop 2
SYMATTR InstName R79
SYMATTR Value 1k
SYMBOL res 1936 4384 R90
WINDOW 0 0 56 VBottom 2
WINDOW 3 32 56 VTop 2
SYMATTR InstName R80
SYMATTR Value 1k
SYMBOL res 2864 1856 R90
WINDOW 0 0 56 VBottom 2
WINDOW 3 32 56 VTop 2
SYMATTR InstName R81
SYMATTR Value 1k
SYMBOL res -496 240 R0
SYMATTR InstName R82
SYMATTR Value 1Meg
SYMBOL res -496 528 R0
SYMATTR InstName R83
SYMATTR Value 1Meg
SYMBOL res -496 768 R0
SYMATTR InstName R84
SYMATTR Value 1Meg
SYMBOL res -480 1264 R0
SYMATTR InstName R85
SYMATTR Value 1Meg
SYMBOL res -496 1008 R0
SYMATTR InstName R86
SYMATTR Value 1Meg
SYMBOL res 3584 1312 R0
SYMATTR InstName R87
SYMATTR Value 1Meg
TEXT 1088 32 Left 2 !.wave "C:\\Analog Eq\\Analog-Equalizer\\LTSpice\\wav_out\\test.wav" 16 44.1k V(vsum)
TEXT -608 1432 Left 2 !.ac dec 1000 10 100k
TEXT -608 1464 Left 2 ;.tran 10

The netlist it stands for:
* analog_eq_linkwitz_riley.asc
C3 N004 N003 43n
C4 N001 N003 43n
R6 N001 N004 523k
R7 N003 V_AC 182k
R8 N003 0 20.2k
X§U2 0 N004 VCC VEE N001 OPAx134  ; pins IN+ IN- VCC VEE OUT
C5 N006 N005 62n
C6 N002 N005 62n
R10 N002 N006 533k
R11 N005 N001 185k
R12 N005 0 20.6k
X§U3 0 N006 VCC VEE N002 OPAx134  ; pins IN+ IN- VCC VEE OUT
V9 Vin 0 wavefile="Radiohead - Weird Fishes"
X§U4 N002 vout_1 VCC VEE vout_1 OPAx134  ; pins IN+ IN- VCC VEE OUT
V4 VCC 0 5
V5 VEE 0 -5
C1 N012 N011 22n
C2 N008 N011 22n
R1 N008 N012 511k
R2 N011 V_AC 177k
R3 N011 0 19.8k
X§U1 0 N012 VCC VEE N008 OPAx134  ; pins IN+ IN- VCC VEE OUT
C7 N014 N013 30n
C8 N009 N013 30n
R4 N009 N014 551k
R5 N013 N008 191k
R9 N013 0 21.4k
X§U5 0 N014 VCC VEE N009 OPAx134  ; pins IN+ IN- VCC VEE OUT
X§U6 0 N010 VCC VEE vout_2 OPAx134  ; pins IN+ IN- VCC VEE OUT
R15 N010 N009 1k
R16 vout_2 N010 1k
V3 V_AC 0 AC 1
X§U7 0 N007 VCC VEE vsum OPAx134  ; pins IN+ IN- VCC VEE OUT
R13 vsum N007 1k
R14 N007 vout_1 1k
R17 N007 vout_2 1k
C9 N018 N017 10n
C10 N015 N017 10n
R18 N015 N018 407k
R19 N017 V_AC 139k
R20 N017 0 28.9k
X§U8 0 N018 VCC VEE N015 OPAx134  ; pins IN+ IN- VCC VEE OUT
C11 N020 N019 16n
C12 N016 N019 16n
R21 N016 N020 424k
R22 N019 N015 145k
R23 N019 0 30.1k
X§U9 0 N020 VCC VEE N016 OPAx134  ; pins IN+ IN- VCC VEE OUT
X§U10 N016 vout_3 VCC VEE vout_3 OPAx134  ; pins IN+ IN- VCC VEE OUT
R24 N007 vout_3 1k
C13 N025 N024 5.1n
C14 N021 N024 5.1n
R25 N021 N025 398k
R26 N024 V_AC 136k
R27 N024 0 28.3k
X§U11 0 N025 VCC VEE N021 OPAx134  ; pins IN+ IN- VCC VEE OUT
C15 N027 N026 8.2n
C16 N022 N026 8.2n
R28 N022 N027 413k
R29 N026 N021 141k
R30 N026 0 29.4k
X§U12 0 N027 VCC VEE N022 OPAx134  ; pins IN+ IN- VCC VEE OUT
X§U13 0 N023 VCC VEE vout_4 OPAx134  ; pins IN+ IN- VCC VEE OUT
R31 N023 N022 1k
R32 vout_4 N023 1k
R33 N007 vout_4 1k
C18 N031 N030 2.4n
C19 N028 N030 2.4n
R35 N028 N031 423k
R36 N030 V_AC 145k
R37 N030 0 30.1k
X§U14 0 N031 VCC VEE N028 OPAx134  ; pins IN+ IN- VCC VEE OUT
C20 N033 N032 4.3n
C21 N029 N032 4.3n
R38 N029 N033 394k
R39 N032 N028 135k
R40 N032 0 28k
X§U15 0 N033 VCC VEE N029 OPAx134  ; pins IN+ IN- VCC VEE OUT
X§U16 N029 vout_5 VCC VEE vout_5 OPAx134  ; pins IN+ IN- VCC VEE OUT
R41 N007 vout_5 1k
C17 N038 N037 1.2n
C22 N034 N037 1.2n
R34 N034 N038 424k
R42 N037 V_AC 145k
R43 N037 0 30.1k
X§U17 0 N038 VCC VEE N034 OPAx134  ; pins IN+ IN- VCC VEE OUT
C23 N040 N039 2n
C24 N035 N039 2n
R44 N035 N040 424k
R45 N039 N034 145k
R46 N039 0 30k
X§U18 0 N040 VCC VEE N035 OPAx134  ; pins IN+ IN- VCC VEE OUT
X§U19 0 N036 VCC VEE vout_6 OPAx134  ; pins IN+ IN- VCC VEE OUT
R47 N036 N035 1k
R48 vout_6 N036 1k
R49 N007 vout_6 1k
C25 N044 N043 1n
C26 N041 N043 1n
R50 N041 N044 255k
R51 N043 V_AC 87.4k
R52 N043 0 18k
X§U20 0 N044 VCC VEE N041 OPAx134  ; pins IN+ IN- VCC VEE OUT
C27 N046 N045 1n
C28 N042 N045 1n
R53 N042 N046 425k
R54 N045 N041 145k
R55 N045 0 29.9k
X§U21 0 N046 VCC VEE N042 OPAx134  ; pins IN+ IN- VCC VEE OUT
X§U22 N042 vout_7 VCC VEE vout_7 OPAx134  ; pins IN+ IN- VCC VEE OUT
R56 N007 vout_7 1k
C29 N051 N050 1n
C30 N047 N050 1n
R57 N047 N051 127k
R58 N050 V_AC 43.5k
R59 N050 0 9.02k
X§U23 0 N051 VCC VEE N047 OPAx134  ; pins IN+ IN- VCC VEE OUT
C31 N053 N052 1n
C32 N048 N052 1n
R60 N048 N053 212k
R61 N052 N047 72.5k
R62 N052 0 15k
X§U24 0 N053 VCC VEE N048 OPAx134  ; pins IN+ IN- VCC VEE OUT
X§U25 0 N049 VCC VEE vout_8 OPAx134  ; pins IN+ IN- VCC VEE OUT
R63 N049 N048 1k
R64 vout_8 N049 1k
R65 N007 vout_8 1k
V13 v_trans 0 PULSE(0 1 50m 10m 10m 50m)
C33 N057 N056 1n
C34 N054 N056 1n
R66 N054 N057 63.6k
R67 N056 V_AC 21.8k
R68 N056 0 4.51k
X§U26 0 N057 VCC VEE N054 OPAx134  ; pins IN+ IN- VCC VEE OUT
C35 N059 N058 1n
C36 N055 N058 1n
R69 N055 N059 106k
R70 N058 N054 36.3k
R71 N058 0 7.52k
X§U27 0 N059 VCC VEE N055 OPAx134  ; pins IN+ IN- VCC VEE OUT
X§U28 N055 vout_9 VCC VEE vout_9 OPAx134  ; pins IN+ IN- VCC VEE OUT
R72 N007 vout_9 1k
C37 N064 N063 750p
C38 N060 N063 750p
R73 N060 N064 42.5k
R74 N063 V_AC 14.5k
R75 N063 0 3k
X§U29 0 N064 VCC VEE N060 OPAx134  ; pins IN+ IN- VCC VEE OUT
C39 N066 N065 1n
C40 N061 N065 1n
R76 N061 N066 53k
R77 N065 N060 18.2k
R78 N065 0 3.75k
X§U30 0 N066 VCC VEE N061 OPAx134  ; pins IN+ IN- VCC VEE OUT
X§U31 0 N062 VCC VEE vout_10 OPAx134  ; pins IN+ IN- VCC VEE OUT
R79 N062 N061 1k
R80 vout_10 N062 1k
R81 N007 vout_10 1k
R82 Vin 0 1Meg
R83 VCC 0 1Meg
R84 VEE 0 1Meg
R85 v_trans 0 1Meg
R86 V_AC 0 1Meg
R87 vsum 0 1Meg
.wave "C:\Analog Eq\Analog-Equalizer\LTSpice\wav_out\test.wav" 16 44.1k V(vsum)
.ac dec 1000 10 100k
* .tran 10
.lib C:\Analog Eq\Analog-Equalizer\LTSpice\sym\OPAx134.lib
.backanno
.end